# EAGLE design MAGBOT21 (EAGLE 7.6.0)
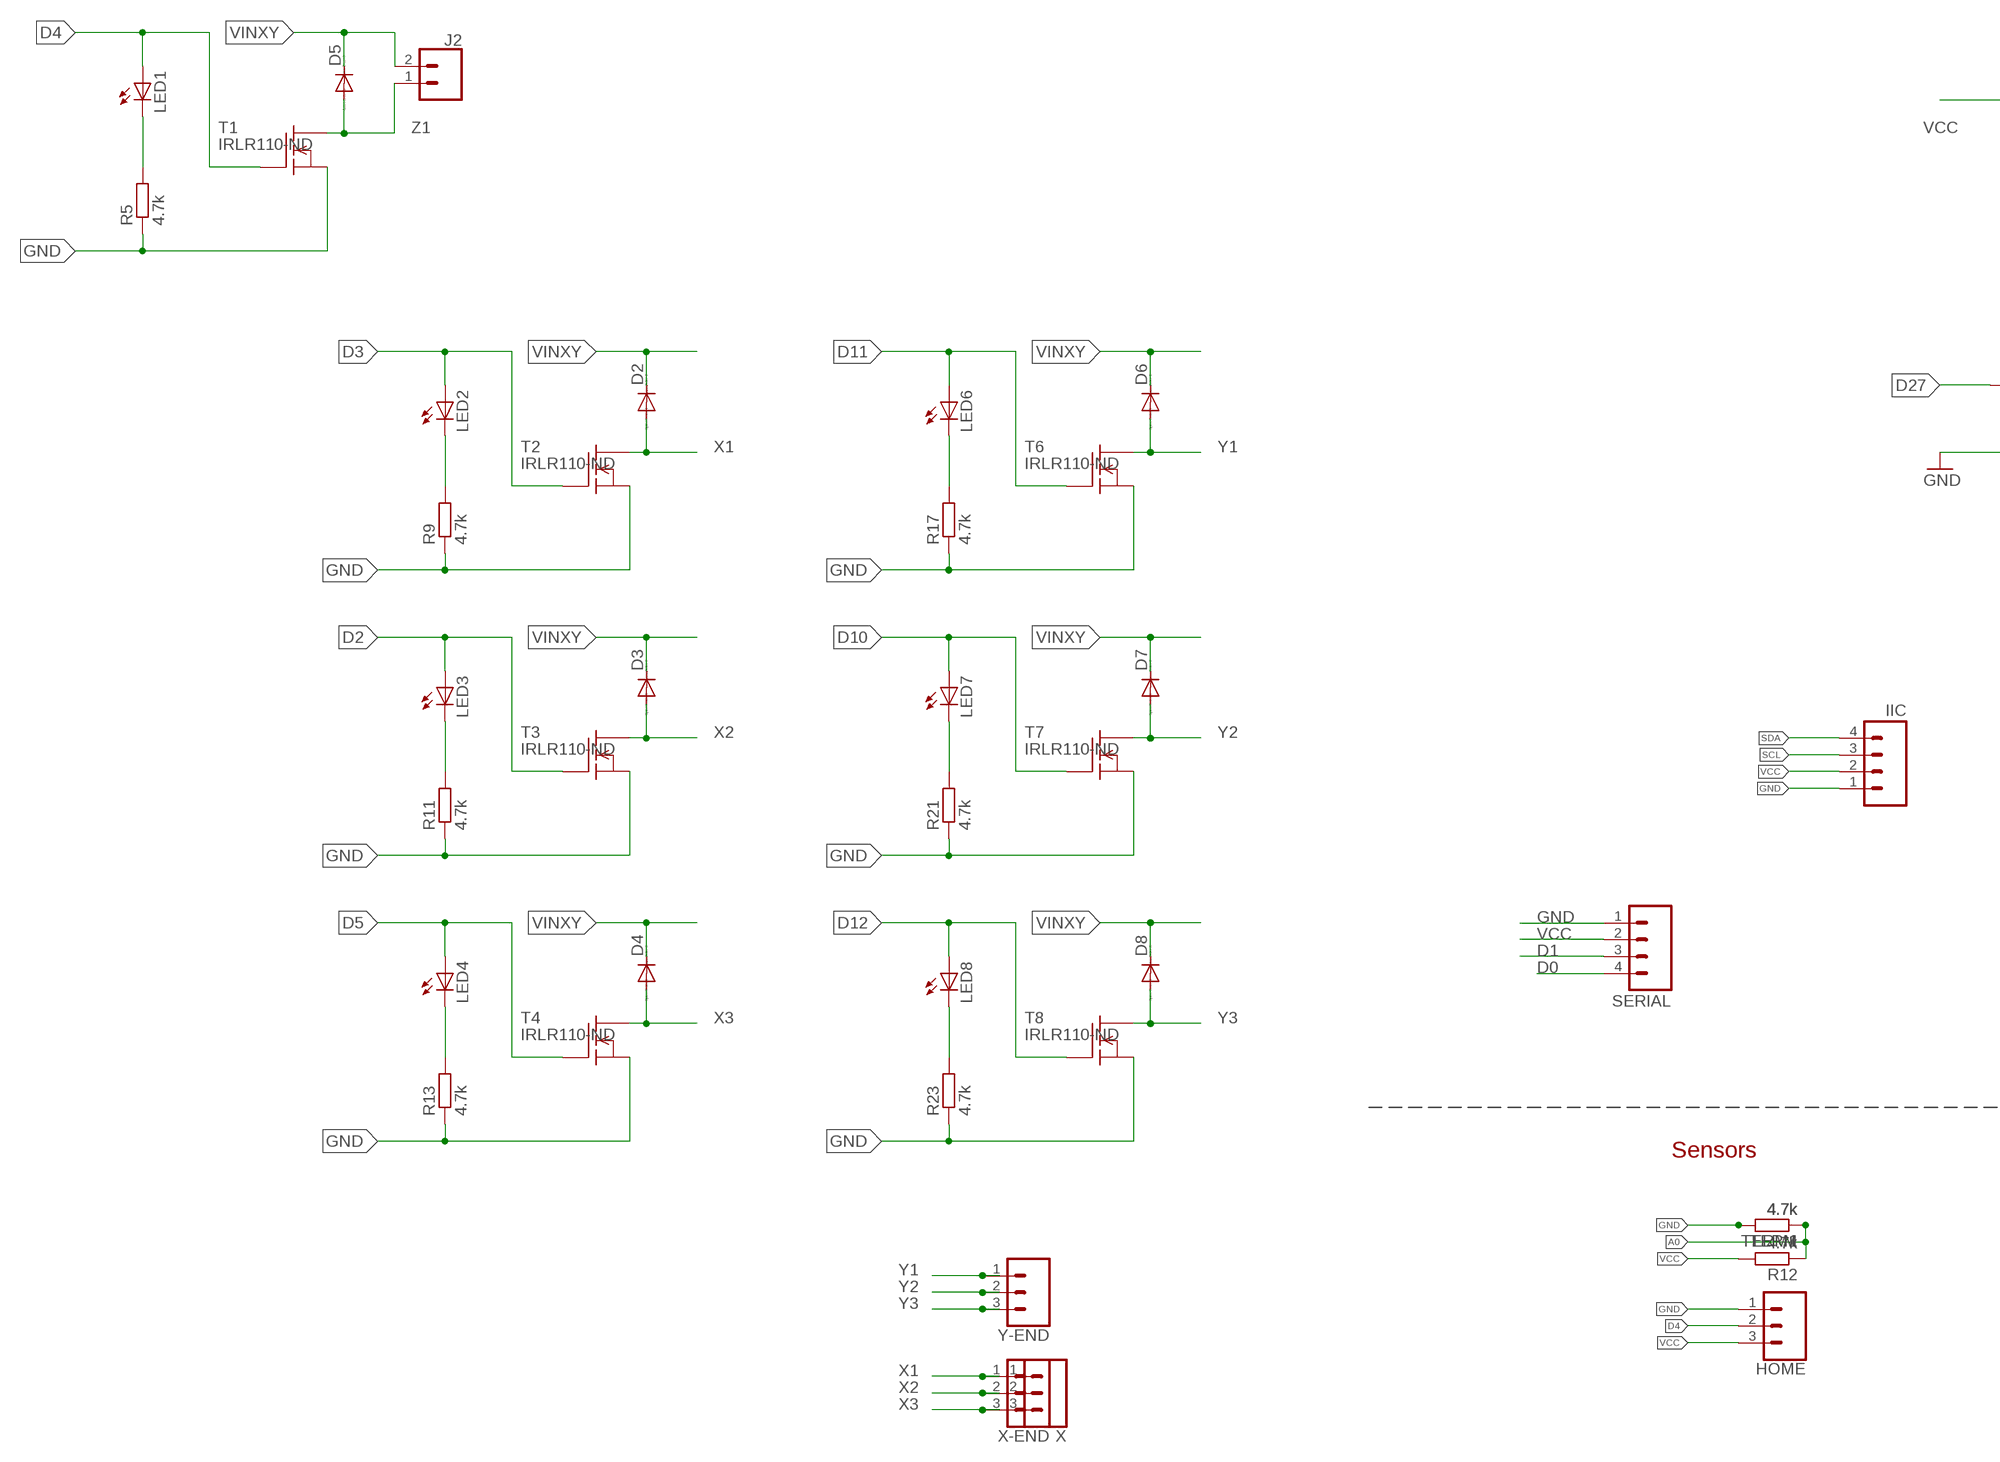
[diagram p0: schematic, sheet 1, part 1 of 2]
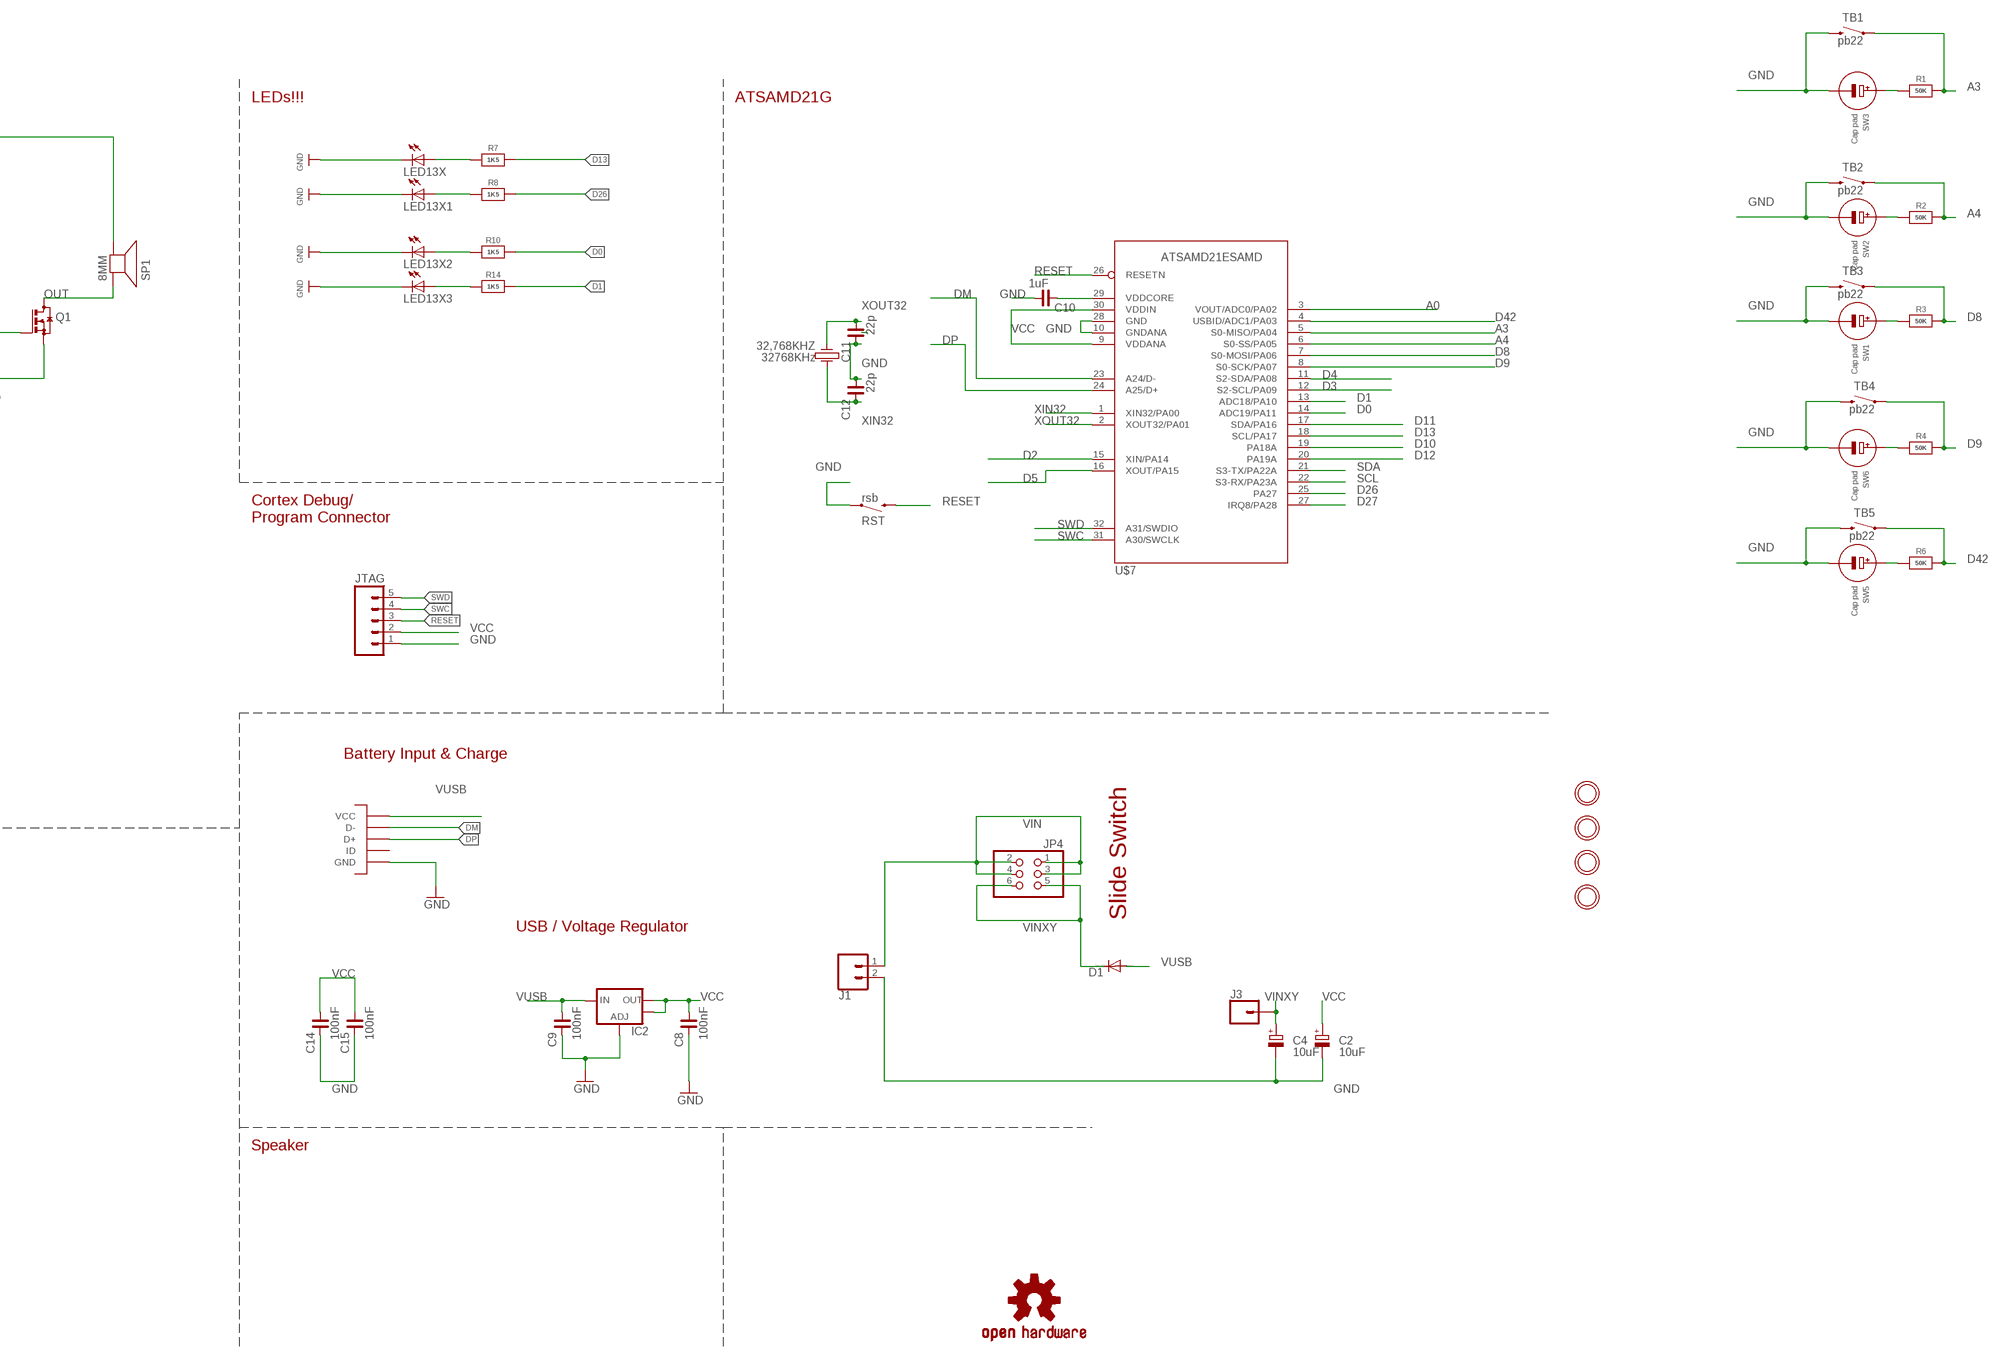
[diagram p1: schematic, sheet 1, part 2 of 2]

## Parts
32,768KHZ  32768KHz  CRYSTALL  [KX-327LT]
C2  10uF  CPOL-EU153CLV-0605  [153CLV-0605]
C4  10uF  CPOL-EU153CLV-0605  [153CLV-0605]
C8  100nF  C_0603  [C0603]
C9  100nF  C_0603  [C0603]
C10  1uF  C_0805  [C0805]
C11  22p  C_0805  [C0805]
C12  22p  C_0805  [C0805]
C14  100nF  C_0805  [C0805]
C15  100nF  C_0805  [C0805]
D1  DIODE-DO214AC  [DO214AC]
D2  DIODE-DO214AC  [DO214AC]
D3  DIODE-DO214AC  [DO214AC]
D4  DIODE-DO214AC  [DO214AC]
D5  DIODE-DO214AC  [DO214AC]
D6  DIODE-DO214AC  [DO214AC]
D7  DIODE-DO214AC  [DO214AC]
D8  DIODE-DO214AC  [DO214AC]
HOME  CONN_031X03_NO_SILK  [1X03_NO_SILK]
IC2  V_REG_LM1117SOT223  [SOT223]
IIC  M041X04_NO_SILK  [1X04_NO_SILK]
J1  CONN_02PTH3  [1X02_LONGPADS]
J2  CONN_02PTH3  [1X02_LONGPADS]
J3  CONN_01PTH_NO_SILK_KIT  [1X01NS_KIT]
JP4  PINHD-2X3  [2X03]
JTAG  M051.27MM  [1X05-1.27MM]
LED1  LEDCHIPLED_0805  [CHIPLED_0805]
LED2  LEDCHIPLED_0805  [CHIPLED_0805]
LED3  LEDCHIPLED_0805  [CHIPLED_0805]
LED4  LEDCHIPLED_0805  [CHIPLED_0805]
LED6  LEDCHIPLED_0805  [CHIPLED_0805]
LED7  LEDCHIPLED_0805  [CHIPLED_0805]
LED8  LEDCHIPLED_0805  [CHIPLED_0805]
LED13X  LEDCHIPLED_0805  [CHIPLED_0805]
LED13X1  LEDCHIPLED_0805  [CHIPLED_0805]
LED13X2  LEDCHIPLED_0603  [CHIPLED_0603]
LED13X3  LEDCHIPLED_0603  [CHIPLED_0603]
LOGO3  OSHW-LOGOS  [OSHW-LOGO-S]
Q1  BSS123  [SOT23]
R1  50K  RESISTOR_0805  [_0805]
R2  50K  RESISTOR_0805  [_0805]
R3  50K  RESISTOR_0805  [_0805]
R4  50K  RESISTOR_0805  [_0805]
R5  4.7k  R-EU_R0603  [R0603]
R6  50K  RESISTOR_0805  [_0805]
R7  1K5  RESISTOR_0805MP  [_0805MP]
R8  1K5  RESISTOR_0603_NOOUT  [0603-NO]
R9  4.7k  R-EU_R0603  [R0603]
R10  1K5  RESISTOR_0603MP  [_0603MP]
R11  4.7k  R-EU_R0603  [R0603]
R12  4.7k  R-EU_R0603  [R0603]
R13  4.7k  R-EU_R0603  [R0603]
R14  1K5  RESISTOR_0603MP  [_0603MP]
R17  4.7k  R-EU_R0603  [R0603]
R21  4.7k  R-EU_R0603  [R0603]
R23  4.7k  R-EU_R0603  [R0603]
RST  rsb  SWITCH-MOMENTARY-2SMD-3  [TACTILE_SWITCH_SMD-3]
SERIAL  M041X04_NO_SILK  [1X04_NO_SILK]
SP1  8MM  SPEAKER_BUZZER5MM  [BUZZER_SMT_5MM]
SW1  Cap pad  SWITCH_CAPTOUCHATMELAT42QT  [CAPTOUCH_SIMPLE_12.5MM]
SW2  Cap pad  SWITCH_CAPTOUCHATMELAT42QT  [CAPTOUCH_SIMPLE_12.5MM]
SW3  Cap pad  SWITCH_CAPTOUCHATMELAT42QT  [CAPTOUCH_SIMPLE_12.5MM]
SW5  Cap pad  SWITCH_CAPTOUCHATMELAT42QT  [CAPTOUCH_SIMPLE_12.5MM]
SW6  Cap pad  SWITCH_CAPTOUCHATMELAT42QT  [CAPTOUCH_SIMPLE_12.5MM]
T1  IRLR110-ND  [TO252]
T2  IRLR110-ND  [TO252]
T3  IRLR110-ND  [TO252]
T4  IRLR110-ND  [TO252]
T6  IRLR110-ND  [TO252]
T7  IRLR110-ND  [TO252]
T8  IRLR110-ND  [TO252]
TB1  pb22  SWITCH-MOMENTARY-2SMD-3  [TACTILE_SWITCH_SMD-3]
TB2  pb22  SWITCH-MOMENTARY-2SMD-3  [TACTILE_SWITCH_SMD-3]
TB3  pb22  SWITCH-MOMENTARY-2SMD-3  [TACTILE_SWITCH_SMD-3]
TB4  pb22  SWITCH-MOMENTARY-2SMD-3  [TACTILE_SWITCH_SMD-3]
TB5  pb22  SWITCH-MOMENTARY-2SMD-3  [TACTILE_SWITCH_SMD-3]
TERM  4.7k  R-EU_R0805W  [R0805W]
TERM1  4.7k  R-EU_R0805W  [R0805W]
U$3  MOUNTINGHOLE2.0  [MOUNTINGHOLE_2.0_PLATED]
U$4  MOUNTINGHOLE2.0  [MOUNTINGHOLE_2.0_PLATED]
U$5  MICROUSB  [MICRO_B]
U$7  ATSAMD21ESAMD  [TQFP32-08]
U$8  MOUNTINGHOLE2.0  [MOUNTINGHOLE_2.0_PLATED]
U$10  MOUNTINGHOLE2.0  [MOUNTINGHOLE_2.0_PLATED]
X  CONN_031X03_NO_SILK  [1X03_NO_SILK]
X-END  CONN_031X03_NO_SILK  [1X03_NO_SILK]
Y-END  CONN_031X03_NO_SILK  [1X03_NO_SILK]

## Nets
A0: R12.1 TERM1.1 TERM.1 U$7.3(VOUT/ADC0/PA02)
A3: R1.1 TB1.1 U$7.5(S0-MISO/PA04)
A4: R2.1 TB2.1 U$7.6(S0-SS/PA05)
D0: R10.1 SERIAL.4 U$7.14(ADC19/PA11)
D1: R14.1 SERIAL.3 U$7.13(ADC18/PA10)
D2: LED3.A T3.1(G) U$7.15(XIN/PA14)
D3: LED2.A T2.1(G) U$7.12(S2-SCL/PA09)
D4: HOME.2 LED1.A T1.1(G) U$7.11(S2-SDA/PA08)
D5: LED4.A T4.1(G) U$7.16(XOUT/PA15)
D8: R3.1 TB3.1 U$7.7(S0-MOSI/PA06)
D9: R4.1 TB4.1 U$7.8(S0-SCK/PA07)
D10: LED7.A T7.1(G) U$7.19(PA18A)
D11: LED6.A T6.1(G) U$7.17(SDA/PA16)
D12: LED8.A T8.1(G) U$7.20(PA19A)
D13: R7.1 U$7.18(SCL/PA17)
D26: R8.1 U$7.25(PA27)
D27: Q1.1(G) U$7.27(IRQ8/PA28)
D42: R6.1 TB5.1 U$7.4(USBID/ADC1/PA03)
DM: U$5.P2(D-) U$7.23(A24/D-)
DP: U$5.P3(D+) U$7.24(A25/D+)
GND [vcc]: C2.- C4.- C8.2 C9.2 C10.1 C11.2 C12.1 C14.2 C15.2 HOME.1 IC2.1(ADJ) IIC.1 J1.2 JTAG.1 LED13X1.C LED13X2.C LED13X3.C LED13X.C Q1.2(S) R5.1 R9.1 R11.1 R13.1 R17.1 R21.1 R23.1 RST.1 SERIAL.1 SW1.G(-) SW2.G(-) SW3.G(-) SW5.G(-) SW6.G(-) T1.2(S) T2.2(S) T3.2(S) T4.2(S) T6.2(S) T7.2(S) T8.2(S) TB1.4 TB2.4 TB3.4 TB4.4 TB5.4 TERM1.2 TERM.2 U$5.GND1(GND) U$5.GND2(GND) U$5.GND3(GND) U$5.GND4(GND) U$5.GND7(GND) U$5.GND8(GND) U$5.P5(GND) U$7.10(GNDANA) U$7.28(GND)
N$1: R6.2 SW5.E(+)
N$2: R4.2 SW6.E(+)
N$3: R3.2 SW1.E(+)
N$5: R2.2 SW2.E(+)
N$6: R1.2 SW3.E(+)
N$7: LED13X1.A R8.2
N$8: LED2.C R9.2
N$10: LED6.C R17.2
N$11: C10.2 U$7.29(VDDCORE)
N$12: LED3.C R11.2
N$14: LED7.C R21.2
N$19: LED4.C R13.2
N$21: LED8.C R23.2
N$22: LED13X.A R7.2
N$23: LED1.C R5.2
N$27: LED13X2.A R10.2
N$28: LED13X3.A R14.2
OUT: Q1.3(D) SP1.+
RESET: JTAG.3 RST.4 U$7.26(RESETN)
SCL: IIC.3 U$7.22(S3-RX/PA23A)
SDA: IIC.4 U$7.21(S3-TX/PA22A)
SWC: JTAG.4 U$7.31(A30/SWCLK)
SWD: JTAG.5 U$7.32(A31/SWDIO)
VCC [gnd]: C2.+ C8.1 C14.1 C15.1 HOME.3 IC2.2(OUT) IC2.4(OUT) IIC.2 JTAG.2 R12.2 SERIAL.2 SP1.- U$7.9(VDDANA) U$7.30(VDDIN)
VIN: J1.1 JP4.1 JP4.2 JP4.3 JP4.4
VINXY [gnd]: C4.+ D1.C D2.C D3.C D4.C D5.C D6.C D7.C D8.C J2.2 J3.1 JP4.5 JP4.6
VUSB: C9.1 D1.A IC2.3(IN) U$5.P1(VCC)
X1: D2.A T2.3(D) X-END.1 X.1
X2: D3.A T3.3(D) X-END.2 X.2
X3: D4.A T4.3(D) X-END.3 X.3
XIN32: 32,768KHZ.1 C12.2 U$7.1(XIN32/PA00)
XOUT32: 32,768KHZ.4 C11.1 U$7.2(XOUT32/PA01)
Y1: D6.A T6.3(D) Y-END.1
Y2: D7.A T7.3(D) Y-END.2
Y3: D8.A T8.3(D) Y-END.3
Z1: D5.A J2.1 T1.3(D)
Unconnected: U$5.P4(ID)

## Notes on the sheet
- LEDs!!! | ATSAMD21G
- Cortex Debug/
  Program Connector
- Battery Input & Charge
- Sensors
- USB / Voltage Regulator | Slide Switch
- Speaker

## Library data of the parts
32,768KHZ = es:CRYSTALL
C2 C4 = rcl:CPOL-EU: POLARIZED CAPACITOR, European symbol
C8-C12 C14 C15 = rc-master-smd:C_: NON-POLARIZED CAP
D1-D8 = diode:DIODE-: DIODE
HOME X X-END Y-END = SparkFun-Connectors:CONN_03: Multi connection point. Often used as Generic Header-pin footprint for 0.1 inch spaced/style header connections On any of the 0.1 inch spaced packages, you can populate with these: Break Away Headers - Straight <https://www.sparkfun.com/products/116> (PRT-00116) Break Away Male Headers - Right Angle <https://www.sparkfun.com/products/553> (PRT-00553) Female Headers <https://www.sparkfun.com/products/115> (PRT-00115) Break Away Headers - Machine Pin <https://www.sparkfun.com/products/117> (PRT-00117) Break Away Female Headers - Swiss Machine Pin <https://www.sparkfun.com/products/743> (PRT-00743) Stackable Header - 3 Pin (Female, 0.1") <https://www.sparkfun.com/products/13875> (PRT-13875) For SCREWTERMINALS and SPRING TERMINALS visit here: Screw Terimnals on SparkFun.com <https://www.sparkfun.com/search/results?term=Screw+Terminals> (5mm/3.5mm/2.54mm spacing) This device is also useful as a general connection point to wire up your design to another part of your project. Our various solder wires solder well into these plated through hole pads. Hook-Up Wire - Assortment (Stranded, 22 AWG) <https://www.sparkfun.com/products/11375> (PRT-11375) Hook-Up Wire - Assortment (Solid Core, 22 AWG) <https://www.sparkfun.com/products/11367> (PRT-11367) View the entire wire category on our website here <https://www.sparkfun.com/categories/141> Special notes: Molex polarized connector foot print use with SKU : PRT-08232 with associated crimp pins and housings.
IC2 = SparkFun:V_REG_LM1117: Voltage Regulator LM1117 Standard adjustable voltage regulator but in SMD form. Spark Fun Electronics SKU : COM-00595
IIC SERIAL = SparkFun:M04: Header 4 Standard 4-pin 0.1" header. Use with straight break away headers (SKU : PRT-00116), right angle break away headers (PRT-00553), swiss pins (PRT-00743), machine pins (PRT-00117), and female headers (PRT-00115). Molex polarized connector foot print use with SKU : PRT-08231 with associated crimp pins and housings.
J1 J2 = SparkFun-Connectors:CONN_02: Multi connection point. Often used as Generic Header-pin footprint for 0.1 inch spaced/style header connections On any of the 0.1 inch spaced packages, you can populate with these: Break Away Headers - Straight <https://www.sparkfun.com/products/116> (PRT-00116) Break Away Male Headers - Right Angle <https://www.sparkfun.com/products/553> (PRT-00553) Female Headers <https://www.sparkfun.com/products/115> (PRT-00115) Break Away Headers - Machine Pin <https://www.sparkfun.com/products/117> (PRT-00117) Break Away Female Headers - Swiss Machine Pin <https://www.sparkfun.com/products/743> (PRT-00743) For SCREWTERMINALS and SPRING TERMINALS visit here: Screw Terimnals on SparkFun.com <https://www.sparkfun.com/search/results?term=Screw+Terminals> (5mm/3.5mm/2.54mm spacing) This device is also useful as a general connection point to wire up your design to another part of your project. Our various solder wires solder well into these plated through hole pads. Hook-Up Wire - Assortment (Stranded, 22 AWG) <https://www.sparkfun.com/products/11375> (PRT-11375) Hook-Up Wire - Assortment (Solid Core, 22 AWG) <https://www.sparkfun.com/products/11367> (PRT-11367) View the entire wire category on our website here <https://www.sparkfun.com/categories/141> Special notes: Molex polarized connector foot print use with: PRT-08233 with associated crimp pins and housings. 2.54_SCREWTERM for use with PRT-10571. 3.5mm Screw Terminal footprints for PRT-08084 5mm Screw Terminal footprints for use with PRT-08432
J3 = SparkFun-Connectors:CONN_01: Single connection point. Often used as Generic Header-pin footprint for 0.1 inch spaced/style header connections On any of the 0.1 inch spaced packages, you can populate with these: Break Away Headers - Straight <https://www.sparkfun.com/products/116> (PRT-00116) Break Away Male Headers - Right Angle <https://www.sparkfun.com/products/553> (PRT-00553) Female Headers <https://www.sparkfun.com/products/115> (PRT-00115) Break Away Headers - Machine Pin <https://www.sparkfun.com/products/117> (PRT-00117) Break Away Female Headers - Swiss Machine Pin <https://www.sparkfun.com/products/743> (PRT-00743) This device is also useful as a general connection point to wire up your design to another part of your project. Our various solder wires solder well into these plated through hole pads. Hook-Up Wire - Assortment (Stranded, 22 AWG) <https://www.sparkfun.com/products/11375> (PRT-11375) Hook-Up Wire - Assortment (Solid Core, 22 AWG) <https://www.sparkfun.com/products/11367> (PRT-11367) View the entire wire category on our website here <https://www.sparkfun.com/categories/141> Special notes: SMTSO-256-ET is a "flush mount" nut for a 4-40 screw. We mostly use this on specialty testbeds; it is a nice way to connect hardware to your PCB at an adjustable hieght. Also note, the SNAP packages are for using a snappable style connector. We sell a baggie of snaps and they are also used on two LilyPad designs: Snap Assortment - 30 pack (male and female) <https://www.sparkfun.com/products/11347> (DEV-11347) LilyPad Arduino SimpleSnap <https://www.sparkfun.com/products/10941> (DEV-10941) LilyPad SimpleSnap Protoboard <https://www.sparkfun.com/products/10940> (DEV-10940)
JP4 = pinhead:PINHD-2X3: PIN HEADER
JTAG = SparkFun-Connectors:M05: Header 5 Standard 5-pin 0.1" header. Use with straight break away headers (SKU : PRT-00116), right angle break away headers (PRT-00553), swiss pins (PRT-00743), machine pins (PRT-00117), and female headers (PRT-00115). Molex polarized connector foot print use with SKU : PRT-08230 with associated crimp pins and housings.
LED1-LED4 LED6-LED8 LED13X LED13X1-LED13X3 = led:LED: LED OSRAM: - CHIPLED LG R971, LG N971, LY N971, LG Q971, LY Q971, LO R971, LY R971 LH N974, LH R974 LS Q976, LO Q976, LY Q976 LO Q996 - Hyper CHIPLED LW Q18S LB Q993, LB Q99A, LB R99A - SideLED LS A670, LO A670, LY A670, LG A670, LP A670 LB A673, LV A673, LT A673, LW A673 LH A674 LY A675 LS A676, LA A676, LO A676, LY A676, LW A676 LS A679, LY A679, LG A679 - Hyper Micro SIDELED® LS Y876, LA Y876, LO Y876, LY Y876 LT Y87S - SmartLED LW L88C, LW L88S LB L89C, LB L89S, LG L890 LS L89K, LO L89K, LY L89K LS L896, LA L896, LO L896, LY L896 - TOPLED LS T670, LO T670, LY T670, LG T670, LP T670 LSG T670, LSP T670, LSY T670, LOP T670, LYG T670 LG T671, LOG T671, LSG T671 LB T673, LV T673, LT T673, LW T673 LH T674 LS T676, LA T676, LO T676, LY T676, LB T676, LH T676, LSB T676, LW T676 LB T67C, LV T67C, LT T67C, LS T67K, LO T67K, LY T67K, LW E67C LS E67B, LA E67B, LO E67B, LY E67B, LB E67C, LV E67C, LT E67C LW T67C LS T679, LY T679, LG T679 LS T770, LO T770, LY T770, LG T770, LP T770 LB T773, LV T773, LT T773, LW T773 LH T774 LS E675, LA E675, LY E675, LS T675 LS T776, LA T776, LO T776, LY T776, LB T776 LHGB T686 LT T68C, LB T68C - Hyper Mini TOPLED® LB M676 - Mini TOPLED Santana® LG M470 LS M47K, LO M47K, LY M47K Source: http://www.osram.convergy.de LUXEON: - LUMILED® LXK2-PW12-R00, LXK2-PW12-S00, LXK2-PW14-U00, LXK2-PW14-V00 LXK2-PM12-R00, LXK2-PM12-S00, LXK2-PM14-U00 LXK2-PE12-Q00, LXK2-PE12-R00, LXK2-PE12-S00, LXK2-PE14-T00, LXK2-PE14-U00 LXK2-PB12-K00, LXK2-PB12-L00, LXK2-PB12-M00, LXK2-PB14-N00, LXK2-PB14-P00, LXK2-PB14-Q00 LXK2-PR12-L00, LXK2-PR12-M00, LXK2-PR14-Q00, LXK2-PR14-R00 LXK2-PD12-Q00, LXK2-PD12-R00, LXK2-PD12-S00 LXK2-PH12-R00, LXK2-PH12-S00 LXK2-PL12-P00, LXK2-PL12-Q00, LXK2-PL12-R00 Source: www.luxeon.com KINGBRIGHT: KA-3528ASYC Source: www.kingbright.com
LOGO3 = SparkFun-Aesthetics:OSHW-LOGO: Open Source Hardware Logo This logo indicates the piece of hardware it is found on incorporates a OSHW license and/or adheres to the definition of open source hardware found here: http://freedomdefined.org/OSHW
Q1 = transistor-small-signal:BSS123: N-CHANNEL MOS FET
R1-R4 R6-R8 R10 R14 = microbuilder:RESISTOR: Resistors For new designs, use the packages preceded by an '_' character since they are more reliable: The following footprints should be used on most boards: _0402 - Standard footprint for regular board layouts _0603 - Standard footprint for regular board layouts _0805 - Standard footprint for regular board layouts _1206 - Standard footprint for regular board layouts For extremely tight-pitch boards where space is at a premium, the following 'micro-pitch' footprints can be used (smaller pads, no silkscreen outline, etc.): _0402MP - Micro-pitch footprint for very dense/compact boards _0603MP - Micro-pitch footprint for very dense/compact boards _0805MP - Micro-pitch footprint for very dense/compact boards _1206MP - Micro-pitch footprint for very dense/compact boards
R5 R9 R11-R13 R17 R21 R23 TERM TERM1 = rcl:R-EU_: RESISTOR, European symbol
RST TB1-TB5 = SparkFun-Electromechanical:SWITCH-MOMENTARY-2: Various NO switches- pushbuttons, reed, etc
SP1 = microbuilder:SPEAKER: SPEAKER Source: Buerklin Added PS12 (for part # PS1240 piezo) http://www.ladyada.net/library/pcb/eaglelibrary.html
SW1-SW3 SW5 SW6 = microbuilder:SWITCH_CAPTOUCH: Capacitive Touch Electrodes
T1-T4 T6-T8 = JVN:IRLR110-ND
U$3 U$4 U$8 U$10 = microbuilder:MOUNTINGHOLE: Mounting Hole For #2 screws (0.086"/2.18mm width, 0.094"/2.4mm hole) use 2.5mm; BOM: EXCLUDE
U$5 = Other:MICROUSB
U$7 = atsamd21E:ATSAMD21E

## Net classes
0 default: width 0.229 mm, drill 0.381 mm, clearance 0.254 mm
1 vcc: width 0.305 mm, drill 0.381 mm, clearance 0.254 mm
2 gnd: width 0.305 mm, drill 0.381 mm, clearance 0.254 mm

## Board
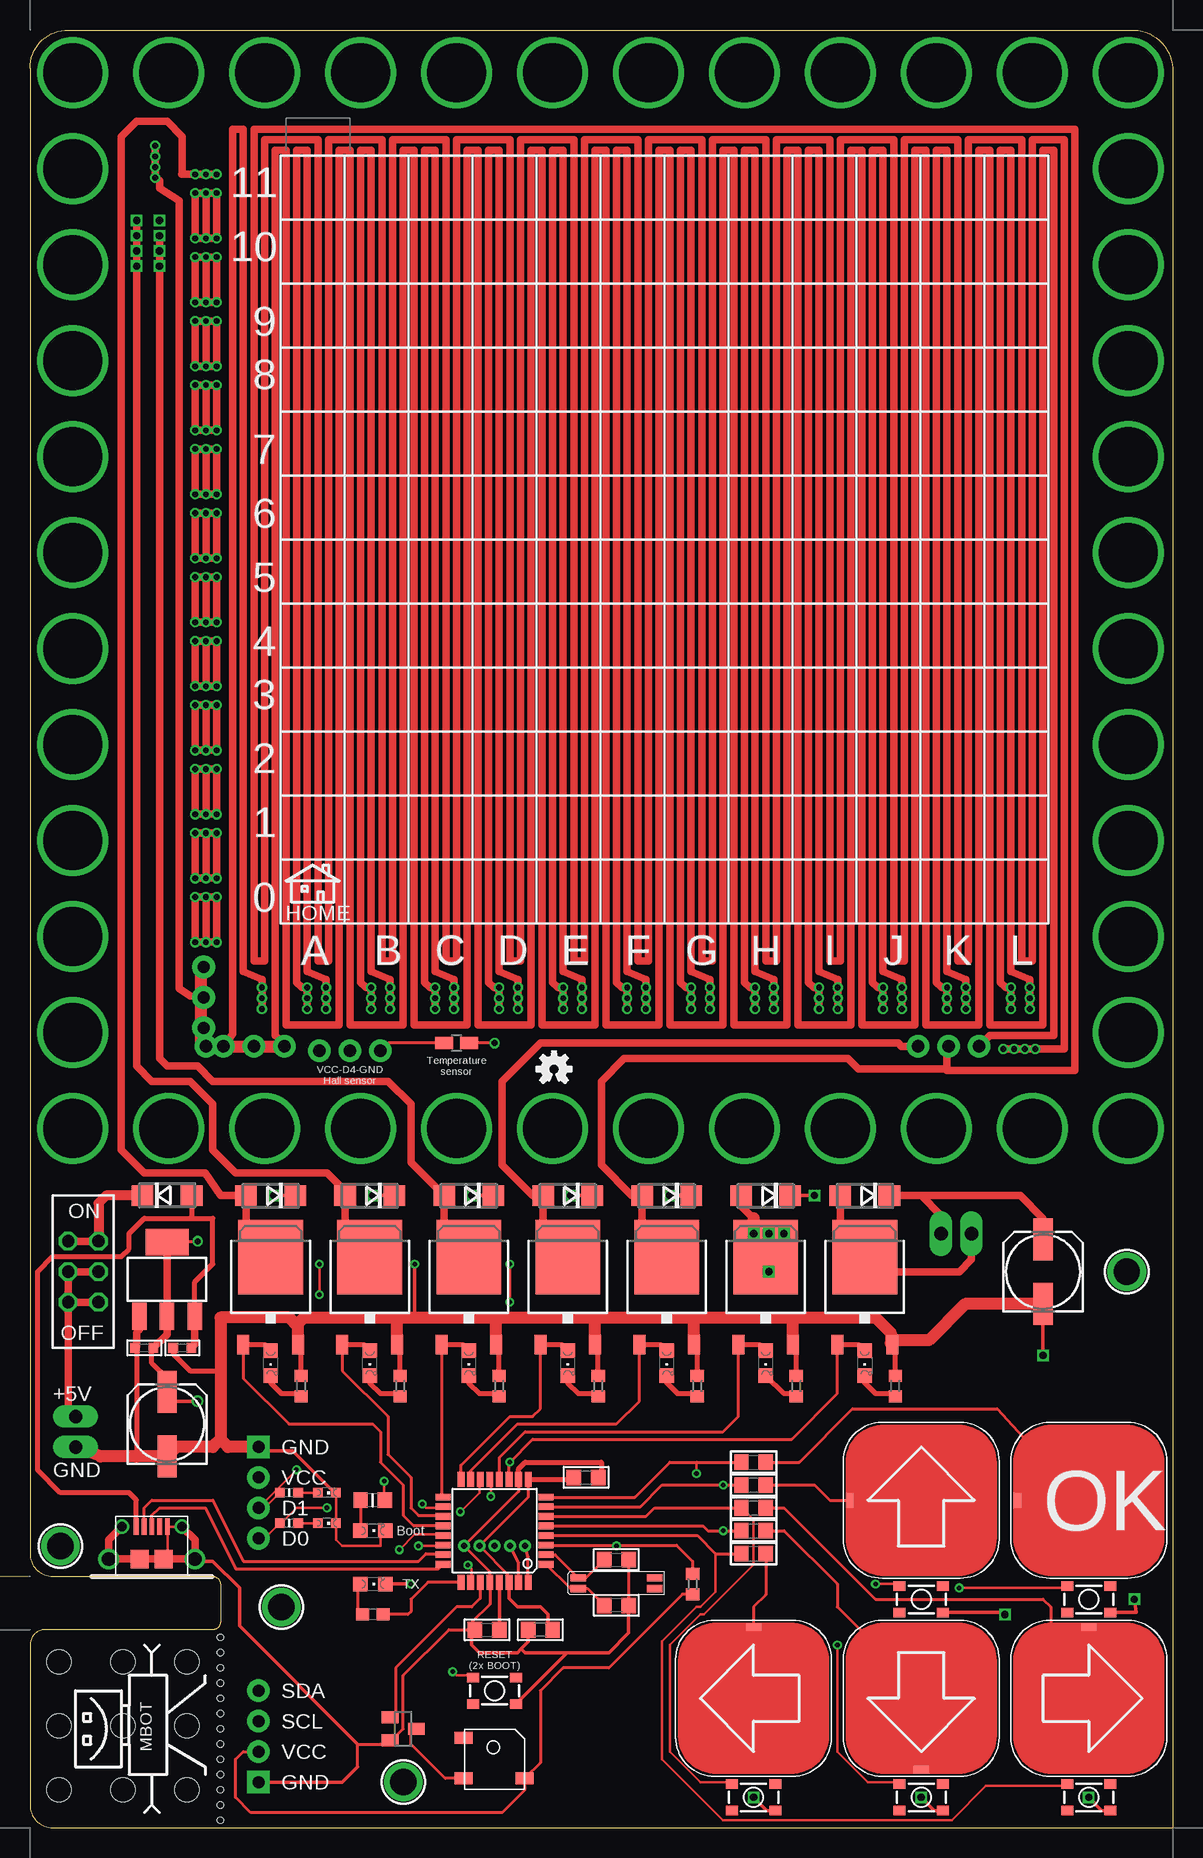
[diagram p2: board, top side]
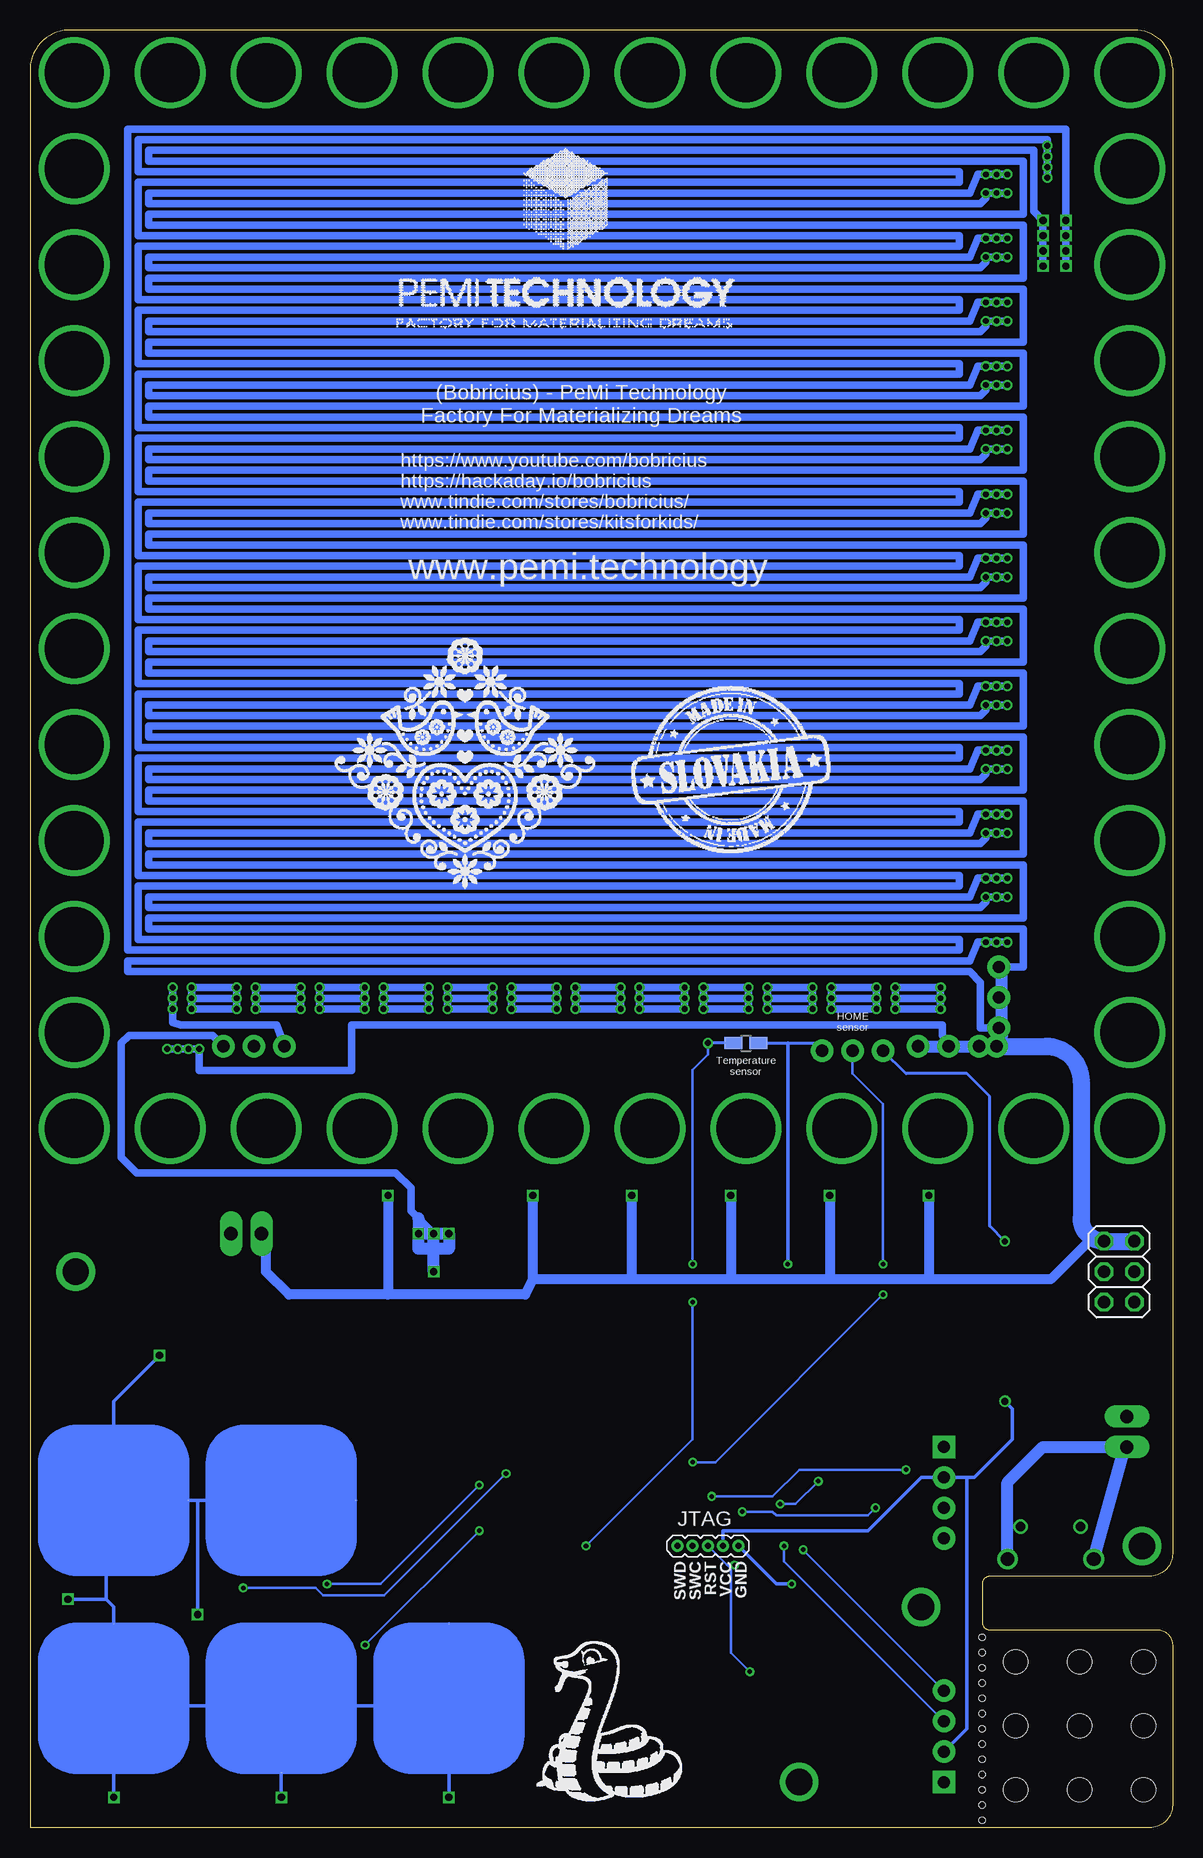
[diagram p3: board, bottom side, seen from below]

Size 95.25 x 149.86 mm. Coordinates in mm from the lower left corner, seen from the top.
Outline: 0,146.69 0,22.86 arc90 1.9,20.95 15.24,20.95 arc-90 15.88,20.32 15.88,17.14 arc-90 15.24,16.51 1.27,16.51 arc90 0,15.24 0,1.91 arc90 1.9,0 95.25,0 95.25,146.69 arc83 92.07,149.86 3.17,149.86 arc90 0,146.69
Copper layers (1*16): Top 0.0356mm / dielectric 1.5011mm / Bottom 0.0356mm
Design rules "LaenPCBOrder *": minimum track width 6mil, minimum drill 13mil, track to track 6mil, track to pad 6mil, pad to pad 6mil, via to via 6mil, smd to smd 6mil, copper to edge 15mil, drill to drill 6mil, minimum pad ring 7mil, minimum via ring 7mil, stop-mask expansion 4mil, vias tented up to drill 30mil, thermal gap 10mil
Holes 2 mm at 13.08,3.17 13.08,8.51 7.75,3.17 7.75,13.84 13.08,13.84 2.41,13.84 2.41,8.51 2.41,3.17 7.75,8.51
Holes 0.5 mm at 15.88,6.98 15.88,8.26 15.88,9.53 15.88,10.79 15.88,12.07 15.88,13.34 15.88,14.61 15.88,15.88 15.88,5.71 15.88,4.45 15.88,3.17 15.88,1.91 15.88,0.64

### Footprints (pad centres in the part's own frame; a part is rotated, then mirrored left to right if it is on the bottom)
KX-327LT = smd 1.3 x 0.6: 1 -3.2,-0.5; 2 3.2,-0.5; 3 3.2,0.4; 4 -3.2,0.4
153CLV-0605 = smd 3.5 x 1.6: + 2.7,0; - -2.7,0
C0603 = smd 0.8 x 0.8: 1 -0.762,0; 2 0.762,0
C0805 = smd 1.2 x 1.3: 1 -1.016,0; 2 1.016,0
DO214AC = smd 1.8 x 1.7: A 2.05,0; C -2.05,0
1X03_NO_SILK = drill 1.016 pad 1.88: 1 0,0; 2 2.54,0; 3 5.08,0
SOT223 = smd 1.219 x 2.235: 1 -2.311,-3.099; 2 0,-3.099; 3 2.311,-3.099 | smd 3.6 x 2.2: 4 0,3.099
1X04_NO_SILK = drill 1.016 pad 1.88 square: 1 0,0 | drill 1.016 pad 1.88: 2 2.54,0; 3 5.08,0; 4 7.62,0
1X02_LONGPADS = drill 1.118 pad 1.88 long: 1 0,0; 2 2.54,0
1X01NS_KIT = drill 1.016 pad 1.88: 1 0,0
2X03 = drill 1.016 octagon: 1 -2.54,-1.27; 2 -2.54,1.27; 3 0,-1.27; 4 0,1.27; 5 2.54,-1.27; 6 2.54,1.27
1X05-1.27MM = drill 0.508 pad 1: 1 0,0; 2 1.27,0; 3 2.54,0; 4 3.81,0; 5 5.08,0
CHIPLED_0805 = smd 1.2 x 1.2: A 0,-1.05; C 0,1.05
CHIPLED_0603 = smd 0.8 x 0.8: A 0,-0.75; C 0,0.75
SOT23 = smd 1 x 1.4: 1 -0.95,-1.1; 2 0.95,-1.1; 3 0,1.1
_0805 = smd 1.2 x 1.3: 1 -1.016,0; 2 1.016,0
R0603 = smd 1 x 1.1: 1 -0.85,0; 2 0.85,0
_0805MP = smd 1.2 x 1.3: 1 -1.016,0; 2 1.016,0
0603-NO = smd 1.1 x 1: 1 -0.85,0; 2 0.85,0
_0603MP = smd 0.8 x 0.8: 1 -0.762,0; 2 0.762,0
TACTILE_SWITCH_SMD-3 = smd 1 x 0.8: 1 -1.8,1.1; 2 1.8,1.1; 3 -1.8,-1.1; 4 1.8,-1.1
BUZZER_SMT_5MM = smd 1.5 x 1: + -2.6,-1.6; - 2.5,-1.6; MT -2.6,1.8
CAPTOUCH_SIMPLE_12.5MM = smd 1.27 x 0.635: E 0,-5.95 | smd 0.1 x 0.1 bottom: G 0,-6.2
TO252 = smd 1 x 1.6: 1 -2.28,-4.8; 2 2.28,-4.8 | smd 5.4 x 6.2: 3 0,2.5
R0805W = smd 1.5 x 1: 1 -1.052,0; 2 1.052,0
MOUNTINGHOLE_2.0_PLATED = drill 2.2 pad 3: P$1 0,0
MICRO_B = smd 1.5 x 1.55: GND1 -1,1.45; GND2 1,1.45 | drill 0.8: GND3 -2.5,4.15; GND4 2.5,4.15 | drill 1.15: GND7 -3.598,1.45; GND8 3.598,1.45 | smd 0.4 x 1.35: P1 -1.3,4.15; P2 -0.65,4.15; P3 0,4.15; P4 0.65,4.15; P5 1.3,4.15
TQFP32-08 = smd 1.27 x 0.559: 1 -4.293,2.8; 2 -4.293,2; 3 -4.293,1.2; 4 -4.293,0.4; 5 -4.293,-0.4; 6 -4.293,-1.2; 7 -4.293,-2; 8 -4.293,-2.8; 17 4.293,-2.8; 18 4.293,-2; 19 4.293,-1.2; 20 4.293,-0.4; 21 4.293,0.4; 22 4.293,1.2; 23 4.293,2; 24 4.293,2.8 | smd 0.559 x 1.27: 9 -2.8,-4.293; 10 -2,-4.293; 11 -1.2,-4.293; 12 -0.4,-4.293; 13 0.4,-4.293; 14 1.2,-4.293; 15 2,-4.293; 16 2.8,-4.293; 25 2.8,4.293; 26 2,4.293; 27 1.2,4.293; 28 0.4,4.293; 29 -0.4,4.293; 30 -1.2,4.293; 31 -2,4.293; 32 -2.8,4.293

### Placement (x,y rotation side)
32,768KHZ  48.9,20.45 0 top
C2  11.43,33.66 90 top
C4  84.46,46.36 90 top
C8  9.53,40.01 180 top
C9  12.7,40.01 180 top
C10  38.1,16.51 0 top
C11  48.9,22.35 0 top
C12  48.9,18.54 180 top
C14  42.55,16.51 180 top
C15  46.35,29.21 0 top
D1  11.43,52.71 0 top
D2  61.34,52.71 180 top
D3  53.09,52.71 180 top
D4  44.83,52.71 180 top
D5  69.6,52.71 180 top
D6  36.58,52.71 180 top
D7  28.32,52.71 180 top
D8  20.07,52.71 180 top
HOME  29.21,64.77 180 top
IC2  11.43,45.72 0 top
IIC  19.05,3.81 90 top
J1  3.81,34.29 270 bottom
J2  78.49,49.53 180 top
J3  14.67,65.15 90 top
JP4  4.45,46.36 90 bottom
JTAG  36.2,23.49 180 bottom
LED1  69.6,38.73 180 top
LED2  61.34,38.73 180 top
LED3  53.09,38.73 180 top
LED4  44.83,38.73 180 top
LED6  36.58,38.73 180 top
LED7  28.32,38.73 180 top
LED8  20.07,38.73 180 top
LED13X  28.58,24.76 270 top
LED13X1  28.58,20.32 270 top
LED13X2  24.77,25.4 270 top
LED13X3  24.77,27.94 270 top
LOGO3  43.69,63.25 0 top
Q1  31.12,8.26 270 top
R1  60.32,24.76 0 top
R2  60.32,26.67 0 top
R3  60.32,28.57 0 top
R4  60.32,30.48 0 top
R5  72.14,36.83 270 top
R6  60.32,22.86 0 top
R7  28.58,27.3 180 top
R8  28.58,17.78 180 top
R9  63.88,36.83 270 top
R10  21.59,25.4 0 top
R11  55.63,36.83 270 top
R12  55.24,20.32 270 top
R13  47.37,36.83 270 top
R14  21.59,27.94 0 top
R17  39.12,36.83 270 top
R21  30.86,36.83 270 top
R23  22.61,36.83 270 top
RST  38.73,11.43 180 top
SERIAL  19.05,31.75 270 top
SP1  38.73,5.71 0 top
SW1  74.29,27.3 270 top
SW2  88.26,10.79 180 top
SW3  74.29,10.79 0 top
SW5  60.32,10.79 180 top
SW6  88.26,27.3 270 top
T1  69.6,45.09 0 top
T2  61.34,45.09 0 top
T3  53.09,45.09 0 top
T4  44.83,45.09 0 top
T6  36.58,45.09 0 top
T7  28.32,45.09 0 top
T8  20.07,45.09 0 top
TB1  74.29,2.54 0 top
TB2  60.32,2.54 0 top
TB3  74.29,19.05 0 top
TB4  88.26,19.05 0 top
TB5  88.26,2.54 0 top
TERM  35.56,65.41 180 top
TERM1  35.56,65.41 0 bottom
U$3  31.12,3.81 0 top
U$4  2.54,23.49 0 top
U$5  10.16,20.95 0 top
U$7  38.73,24.76 180 top
U$8  20.95,18.41 0 top
U$10  91.44,46.36 0 top
X  79.12,65.15 180 top
X-END  21.21,65.15 180 top
Y-END  14.48,71.75 270 top

### Tracks (layer width: path | path; a pad name or v marks a point on that pad's centre or on a via)
A0  (via drill 0.38, 0.5)
  Top 0.229: v40.01,43.82 v40.01,46.99 | v48.9,23.49 48.9,23.56
  Top 0.254: U$7.3 48.9,23.56 53.91,23.56 55.24,22.22 R12.1 | v38.73,65.41 TERM1.1
  Bottom 0.229: v38.73,65.41 38.73,64.45 40.01,63.18 v40.01,46.99 | v40.01,43.82 40.01,32.38 v48.9,23.49
  Bottom 0.254: TERM1.1 v38.73,65.41
A3  (via drill 0.38)
  Top 0.229: v67.31,15.24 67.31,6.35 69.85,3.81 72.39,3.81 TB1.1
  Top 0.254: U$7.5 56.12,25.16 56.52,24.76 v57.78,24.76 R1.1
  Bottom 0.229: v57.78,24.76 v67.31,15.24
A4
  Top 0.229: TB2.1 58.42,3.81 55.88,3.81 53.34,6.35 53.34,15.24 55.88,17.78 56.2,17.78 60.32,21.91 60.32,25.72 59.37,26.67 R2.1
  Top 0.254: U$7.6 51.37,25.96 52.07,26.67 R2.1
D0  (via drill 0.38)
  Top 0.203: SERIAL.4 19.56,24.13 R10.1
  Top 0.229: v35.88,26.35 37.46,27.94 37.46,28.89 U$7.14 | v24.77,26.67 22.23,26.67 20.95,25.4 R10.1
  Bottom 0.229: v35.88,26.35 33.34,26.35 33.02,26.04 25.4,26.04 v24.77,26.67
D1  (via drill 0.38)
  Top 0.203: SERIAL.3 19.56,26.67 R14.1
  Top 0.229: v38.42,27.62 38.42,28.89 U$7.13 | SERIAL.3 v22.23,29.84
  Bottom 0.229: v38.42,27.62 33.34,27.62 31.12,29.84 v22.23,29.84
D2
  Top 0.254: U$7.15 36.73,29.75 40.64,33.66 48.9,33.66 50.8,35.56 T3.1
  Top 0.406: T3.1 52.59,40.29 LED3.A
D3
  Top 0.254: U$7.12 39.13,30.88 41.27,33.02 57.78,33.02 59.05,34.29 T2.1
  Top 0.406: T2.1 60.84,40.29 LED2.A
D4  (via drill 0.38)
  Top 0.229: v24.13,44.45 v24.13,46.99
  Top 0.254: U$7.11 39.94,30.41 v40.01,30.48 41.91,32.38 63.5,32.38 67.31,36.2 T1.1
  Top 0.406: T1.1 69.1,40.29 LED1.A
  Bottom 0.229: HOME.2 26.67,62.87 24.13,60.33 v24.13,46.99 | v24.13,44.45 38.1,30.48 v40.01,30.48
D5
  Top 0.254: U$7.16 35.94,30.22 40.01,34.29 41.91,34.29 42.55,34.92 T4.1
  Top 0.406: T4.1 44.33,40.29 LED4.A
D8  (via drill 0.38)
  Top 0.229: v70.49,20.32 72.39,20.32 TB3.1
  Top 0.254: U$7.7 50.9,26.76 52.7,28.57 v57.78,28.57 R3.1
  Bottom 0.229: v70.49,20.32 66.04,20.32 v57.78,28.57
D9  (via drill 0.38)
  Top 0.229: v77.47,20 86.36,20 TB4.1 | 55.56,30.48 v55.56,29.53
  Top 0.254: U$7.8 50.42,27.56 53.34,30.48 55.56,30.48 R4.1
  Bottom 0.229: v77.47,20 71.44,20 70.8,19.37 65.72,19.37 v55.56,29.53
D10
  Top 0.254: T7.1 26.04,38.09 29.84,34.29 29.84,31.11 31.75,29.21 31.75,26.67 32.38,26.04 34.37,26.04 U$7.19
  Top 0.406: T7.1 27.82,40.29 LED7.A
D11
  Top 0.254: T6.1 34.3,27.71 U$7.17
  Top 0.406: T6.1 36.08,40.29 LED6.A
D12
  Top 0.254: T8.1 17.79,37.46 21.59,33.66 28.58,33.66 29.21,33.02 29.21,30.48 31.12,28.57 31.12,26.04 31.98,25.16 U$7.20
  Top 0.406: T8.1 19.57,40.29 LED8.A
D13  (via drill 0.38)
  Top 0.229: v32.7,26.99 33.02,26.67 34.29,26.67 U$7.18 | v29.53,28.89 29.53,27.3 R7.1
  Bottom 0.229: v32.7,26.99 31.43,26.99 v29.53,28.89
D26
  Top 0.254: U$7.25 33.17,20.47 31.75,19.05 31.75,18.03 31.5,17.78 R8.1
D27
  Top 0.254: U$7.27 37.53,19.12 36.83,18.41 35.56,18.41 30.48,13.34 30.48,9.67 Q1.1
D42
  Top 0.229: 57.15,22.86 57.15,19.68 55.88,18.41 55.56,18.41 52.7,15.56 52.7,5.71 57.78,0.64 76.84,0.64 79.69,3.49 86.36,3.49 TB5.1
  Top 0.254: U$7.4 55.65,24.36 57.15,22.86 R6.1
DM
  Top 0.254: U$5.P2 9.51,26.65 10.16,27.3 15.24,27.3 17.78,22.22 32.38,22.22 33.02,22.86 34.35,22.86 U$7.23
DP
  Top 0.254: U$5.P3 10.16,26.04 10.79,26.67 14.61,26.67 17.14,21.59 34.07,21.59 U$7.24
GND  (via drill 0.38, 0.6)
  Top 0.203: LED13X3.C LED13X2.C 25.52,24.01 26.04,23.49 29.21,23.49 29.21,24.35 LED13X.C | U$5.GND4 U$5.P5 11.46,22.25 11.43,22.22 13.97,22.22
  Top 0.254: C11.2 C12.1 | U$7.10 40.73,28.04 JTAG.1 38.34,21.36 U$7.28 38.34,18.65 36.83,17.14 36.83,16.76 C10.1 34.92,16.51 31.12,12.7 31.12,8.26 30.16,7.3 Q1.2 29.84,7.13 29.21,6.98 27.3,6.98 27.3,5.08 | TERM1.2 29.84,65.41 HOME.1
  Top 0.305: TB2.4 61.43,1.44 v60.32,2.54 | TB1.4 75.4,1.44 v74.29,2.54 | TB5.4 89.37,1.44 v88.26,2.54 | v84.46,39.37 C4.- | TB3.4 81.11,17.95 v81.28,17.78 | TB4.4 92.25,17.95 v92.07,19.05 | 27.3,5.08 26.04,3.81 IIC.1 | C14.2 41.53,15.49 40.96,14.92 | 40.96,14.92 40.64,14.61 37.46,14.61 36.83,15.24 36.83,16.26 C10.1 | C12.1 49.91,16.26 48.26,14.61 44.77,14.61 | 44.77,14.61 41.27,14.61 40.96,14.92 | LED13X3.C 25.4,27.94 21.91,31.43 19.37,31.43 SERIAL.1 | 44.77,14.61 40.64,10.48 RST.1 | v31.75,20.32 LED13X1.C | 27.3,6.98 17.46,16.83 17.46,20 15.24,22.22 13.97,22.22 U$5.GND8 | 32.07,42.55 v32.07,46.99
  Top 0.406: 8.89,40.13 8.89,30.95 | C9.2 11.94,39.5 13.34,38.1 15.88,38.1 | R5.1 72.14,40.03 T1.2 | R9.1 63.88,40.03 T2.2 | R11.1 55.63,40.03 T3.2 | R13.1 47.37,40.03 T4.2 | R17.1 39.12,40.03 T6.2 | R21.1 30.86,40.03 T7.2 | R23.1 22.61,40.03 T8.2 | U$7.10 40.73,29.94 41.27,30.48 47.62,30.48 47.62,29.46 C15.2
  Top 0.61: U$5.GND3 6.56,24.01 U$5.GND7 U$5.GND1 U$5.GND2 U$5.GND8 13.76,24.01 U$5.GND4 | IC2.1 9.12,41.5 8.89,41.28 8.89,40.13 C8.2
  Top 1.016: T8.2 22.35,42.03 | 22.35,42.03 22.86,42.55 30.48,42.55 | 30.48,42.55 32.07,42.55 38.73,42.55 | 38.73,42.55 46.99,42.55 | 46.99,42.55 55.24,42.55 | 55.24,42.55 63.5,42.55 | 63.5,42.55 70.49,42.55 71.75,41.28 71.75,40.41 T1.2 72.23,40.64 74.93,40.64 77.94,43.66 C4.- | T2.2 63.62,42.42 63.5,42.55 | T3.2 55.37,42.42 55.24,42.55 | T4.2 47.11,42.42 46.99,42.55 | T6.2 38.86,42.42 38.73,42.55 | T7.2 30.6,42.42 30.48,42.55 | 22.35,42.03 22.1,42.03 21.59,42.55 15.88,42.55 15.88,38.1 15.88,32.38 | 15.88,32.38 15.24,31.75 12.23,31.75 C2.- 8.89,30.95 5.88,30.95 J1.2 | SERIAL.1 16.51,31.75 15.88,32.38
  Bottom 0.254: TERM1.2 32.07,65.41 29.84,65.41 HOME.1
  Bottom 0.305: v60.32,2.54 SW5.G 60.32,10.79 60.96,10.16 74.29,10.16 | v74.29,2.54 SW3.G 74.29,10.16 | v88.26,2.54 88.26,10.16 | 88.26,10.16 SW2.G 88.26,18.41 88.9,19.05 | 88.9,19.05 88.9,26.67 88.26,27.3 | 88.26,27.3 SW6.G 81.28,27.3 | SW1.G 81.28,27.3 | 74.29,10.16 88.26,10.16 | 88.26,27.3 88.26,35.56 v84.46,39.37 | v81.28,17.78 81.28,27.3 | v92.07,19.05 88.9,19.05 | v31.75,20.32 33.02,20.32 JTAG.1 | v32.07,46.99 32.07,65.41
  Bottom 1.016: U$5.GND7 4.02,31.54 J1.2 10.79,31.75 13.76,28.79 U$5.GND8
N$1
  Top 0.254: R6.2 61.34,19.43 60.32,18.41 SW5.E
N$2
  Top 0.254: R4.2 64.13,30.48 68.58,34.92 80.65,34.92 83.19,32.15 SW6.E
N$3
  Top 0.254: R3.2 65.41,28.57 66.68,27.3 SW1.E
N$5
  Top 0.254: R2.2 62.87,26.67 70.49,19.05 84.46,19.05 85.09,18.41 85.09,16.51 SW2.E
N$6
  Top 0.254: R1.2 62.87,24.76 67.31,20.32 67.31,18.41 69.22,16.51 71.12,15.24 71.12,5.08 SW3.E
N$7
  Top 0.254: LED13X1.A 27.3,20.32 27.3,17.78 R8.2
N$8
  Top 0.406: LED2.C 61.37,37.69 62.87,36.2 63.67,36.2 R9.2
N$10
  Top 0.406: LED6.C 36.58,37.08 37.46,36.2 38.9,36.2 R17.2
N$11
  Top 0.305: U$7.29 39.13,16.53 C10.2
N$12
  Top 0.406: LED3.C 53.09,37.08 53.98,36.2 55.41,36.2 R11.2
N$14
  Top 0.406: LED7.C 28.32,37.08 29.21,36.2 30.65,36.2 R21.2
N$19
  Top 0.406: LED4.C 44.83,37.08 45.72,36.2 47.16,36.2 R13.2
N$21
  Top 0.406: LED8.C 20.07,37.08 20.95,36.2 22.39,36.2 R23.2
N$22
  Top 0.254: R7.2 27.56,24.8 LED13X.A
N$23
  Top 0.406: LED1.C 69.6,37.08 70.49,36.2 71.92,36.2 R5.2
N$25
  Bottom 1.016: 21.34,65.15 15.11,65.15 14.22,66.04 14.22,71.37
N$26
  Top 1.016: 14.22,71.37 14.22,65.15 21.34,65.15
N$27
  Top 0.203: R10.2 LED13X2.A
N$28
  Top 0.203: R14.2 LED13X3.A
N$29  (via drill 4.9)
  other vias: 75.56,58.29
N$30  (via drill 4.9)
  other vias: 51.55,58.29
N$31  (via drill 4.9)
  other vias: 83.56,58.29
N$32  (via drill 4.9)
  other vias: 59.55,58.29
N$33  (via drill 4.9)
  other vias: 67.56,58.29
N$34  (via drill 4.9)
  other vias: 43.55,58.29
N$35  (via drill 4.9)
  other vias: 83.56,146.29
N$36  (via drill 4.9)
  other vias: 91.56,66.29
N$37  (via drill 4.9)
  other vias: 35.55,58.29
N$38  (via drill 4.9)
  other vias: 27.55,58.29
N$39  (via drill 4.9)
  other vias: 19.55,58.29
N$41  (via drill 4.9)
  other vias: 11.55,58.29
N$43  (via drill 4.9)
  other vias: 3.55,58.29
N$44  (via drill 4.9)
  other vias: 3.55,66.29
N$46  (via drill 4.9)
  other vias: 3.55,74.29
N$49  (via drill 4.9)
  other vias: 3.55,82.29
N$50  (via drill 4.9)
  other vias: 3.55,90.29
N$51  (via drill 4.9)
  other vias: 3.55,98.29
N$52  (via drill 4.9)
  other vias: 3.55,106.29
N$53  (via drill 4.9)
  other vias: 3.55,114.29
N$54  (via drill 4.9)
  other vias: 3.55,122.29
N$55  (via drill 4.9)
  other vias: 3.55,130.29
N$56  (via drill 4.9)
  other vias: 3.55,138.29
N$57  (via drill 4.9)
  other vias: 3.55,146.29
N$58  (via drill 4.9)
  other vias: 11.55,146.29
N$59  (via drill 4.9)
  other vias: 19.55,146.29
N$60  (via drill 4.9)
  other vias: 27.55,146.29
N$61  (via drill 4.9)
  other vias: 35.55,146.29
N$62  (via drill 4.9)
  other vias: 43.55,146.29
N$63  (via drill 4.9)
  other vias: 51.55,146.29
N$64  (via drill 4.9)
  other vias: 59.55,146.29
N$65  (via drill 4.9)
  other vias: 67.56,146.29
N$66  (via drill 4.9)
  other vias: 75.56,146.29
N$67  (via drill 4.9)
  other vias: 91.56,146.29
N$68  (via drill 4.9)
  other vias: 91.56,138.29
N$69  (via drill 4.9)
  other vias: 91.56,130.29
N$70  (via drill 4.9)
  other vias: 91.56,122.29
N$71  (via drill 4.9)
  other vias: 91.56,114.29
N$72  (via drill 4.9)
  other vias: 91.56,106.29
N$73  (via drill 4.9)
  other vias: 91.56,98.29
N$74  (via drill 4.9)
  other vias: 91.56,90.29
N$75  (via drill 4.9)
  other vias: 91.56,82.29
N$76  (via drill 4.9)
  other vias: 91.56,74.29
N$77  (via drill 4.9)
  other vias: 91.56,58.29
OUT
  Top 0.254: SP1.+ 34.62,4.12 31.75,6.98 31.75,7.79 Q1.3
RESET  (via drill 0.38)
  Top 0.229: v35.24,13.02 35.56,12.7 37.15,12.7 RST.4 | v36.51,21.91 36.83,21.59 36.83,20.64 U$7.26
  Bottom 0.229: 37.15,21.91 36.83,21.59 36.83,14.61 v35.24,13.02 | JTAG.3 37.15,21.91 | 37.15,21.91 v36.51,21.91
SCL  (via drill 0.38)
  Top 0.229: v32.38,23.49 34.29,23.49 U$7.22
  Bottom 0.229: v32.38,23.49 32.38,22.22 IIC.3
SDA  (via drill 0.38)
  Top 0.229: v30.8,23.18 32.07,24.45 34.29,24.45 U$7.21
  Bottom 0.229: IIC.4 v30.8,23.18
SWC
  Top 0.254: U$7.31 40.73,22.13 JTAG.4
SWD
  Top 0.254: U$7.32 41.53,22.6 JTAG.5
VCC  (via drill 0.5, 0.6)
  Top 0.254: U$7.9 41.53,27.56 JTAG.2 39.94,21.02 U$7.30 | IIC.2 17.78,6.35 17.14,5.71 17.14,2.54 18.41,1.27 39.37,1.27 41.23,3.13 SP1.- 42.55,5.42 42.55,11.43 44.45,13.34 48.26,13.34 54.4,19.47 R12.2 | IC2.4 11.51,48.9 v13.97,48.9
  Top 0.305: v13.97,35.56 12.23,35.56 C2.+ | U$7.30 39.94,19.12 40.64,18.41 42.55,18.41 43.18,17.78 43.18,16.89 C14.1
  Top 0.406: C2.+ 11.43,37.47 10.16,38.73 10.16,39.88 C8.1 | U$7.9 45.19,29.06 C15.1
  Top 0.61: C8.1 11.43,41.15 IC2.2 IC2.4
  Bottom 0.254: v13.97,48.9 15.24,50.16 15.24,60.96 17.14,62.87 22.23,62.87 HOME.3
  Bottom 0.305: JTAG.2 37.46,24.76 25.4,24.76 20.95,29.21 SERIAL.2 17.14,29.21 | 17.14,29.21 16.51,29.21 13.34,32.38 13.34,34.92 v13.97,35.56 | 17.14,29.21 17.14,8.26 IIC.2
VIN
  Top 0.61: JP4.1 JP4.3 JP4.4 | JP4.2 JP4.1 | JP4.1 3.17,34.92 J1.1
VINXY  (via drill 0.6)
  Top 0.305: D8.C v20.32,52.71 | v28.58,52.71 D7.C | v36.83,52.71 D6.C | v45.09,52.71 D4.C | v53.34,52.71 D3.C | D2.C v65.41,52.71
  Top 0.61: JP4.5 JP4.6 | J2.2 75.95,51.05 74.29,52.71 D5.C 82.55,52.71 84.46,50.8 C4.+
  Top 0.813: D1.C 6.35,52.71 5.71,52.07 JP4.6
  Bottom 0.813: JP4.6 6.98,48.9 10.16,45.72 20.32,45.72 | 20.32,45.72 28.58,45.72 | 28.58,45.72 36.83,45.72 | 36.83,45.72 45.09,45.72 | 45.09,45.72 53.34,45.72 | 53.34,45.72 53.98,44.45 65.41,44.45 | 65.41,44.45 73.66,44.45 75.56,46.36 75.56,49.15 J2.2 | v20.32,52.71 20.32,45.72 | v28.58,52.71 28.58,45.72 | v36.83,52.71 36.83,45.72 | v45.09,52.71 45.09,45.72 | v53.34,52.71 53.34,45.72 | v65.41,52.71 65.41,44.45
  Bottom 1.422: J3.1 10.54,65.15 arc90 7.62,62.23 7.62,50.8 arc-90 JP4.6 JP4.5
VUSB
  Top 0.406: IC2.3 13.74,45.49 15.24,46.99 15.24,50.8 13.34,50.8 | U$5.P1 8.86,27.33 8.25,27.94 2.54,27.94 0.63,29.84 0.63,46.36 1.9,47.62 7.62,47.62 8.25,48.26 8.25,49.53 9.53,50.8 13.34,50.8 | D1.A 13.48,50.95 13.34,50.8
  Top 0.61: IC2.3 13.74,40.28 C9.1
X1  (via drill 0.6)
  Top 0.61: X.1 80.01,66.04 85.34,66.04 85.34,139.83 84.46,139.83 84.46,66.93 80.01,66.93 80.01,139.83 79.12,139.83 79.12,66.93 74.68,66.93 74.68,139.83 73.79,139.83 73.79,66.93 69.34,66.93 69.34,139.83 68.45,139.83 68.45,66.93 64.01,66.93 64.01,139.83 63.12,139.83 63.12,66.93 58.67,66.93 58.67,139.83 57.78,139.83 57.78,66.93 53.34,66.93 53.34,139.83 52.45,139.83 52.45,66.93 48.01,66.93 48.01,139.83 47.12,139.83 47.12,66.93 42.67,66.93 42.67,139.83 41.78,139.83 41.78,66.93 37.34,66.93 37.34,139.83 36.45,139.83 36.45,66.93 32,66.93 32,139.83 31.12,139.83 31.12,66.93 26.67,66.93 26.67,139.83 25.78,139.83 25.78,66.93 21.34,66.93 21.34,139.83 20.45,139.83 20.45,66.04 21.21,65.41 X-END.1 | T2.3 61.6,47.84 v61.6,49.53 60.32,50.8 59.29,51.83 D2.A
  Top 1.016: v62.87,49.53 62.87,46.99 | 60.32,50.8 v60.32,49.53 | v61.6,49.53 v61.6,46.36
  Bottom 0.61: X.1 80.01,66.04 87,66.04 87.63,65.41 87.63,55.88 86.36,54.61 64.77,54.61 63.5,53.34 63.5,51.44 62.87,50.8 v61.6,49.53
  Bottom 1.016: 62.87,50.8 v62.87,49.53 | v62.87,49.53 62.87,48.26 60.32,48.26 v60.32,49.53 v61.6,49.53 | v62.87,49.53 v61.6,49.53 | v61.6,46.36 v61.6,49.53
X2  (via drill 0.48)
  Top 0.61: 76.45,63.27 76.45,63.12 87.12,63.12 87.12,141.6 18.67,141.6 18.67,72.26 19.56,72.26 19.56,140.72 24,140.72 24,72.26 24.89,72.26 24.89,140.72 29.34,140.72 29.34,72.26 30.23,72.26 30.23,140.72 34.67,140.72 34.67,72.26 35.56,72.26 35.56,140.72 40.01,140.72 40.01,72.26 40.89,72.26 40.89,140.72 45.34,140.72 45.34,72.26 46.23,72.26 46.23,140.72 50.67,140.72 50.67,72.26 51.56,72.26 51.56,140.72 56.01,140.72 56.01,72.26 56.9,72.26 56.9,140.72 61.34,140.72 61.34,72.26 62.23,72.26 62.23,140.72 66.68,140.72 66.68,72.26 67.56,72.26 67.56,140.72 72.01,140.72 72.01,72.26 72.9,72.26 72.9,140.72 77.34,140.72 77.34,72.26 78.23,72.26 78.23,140.72 82.68,140.72 82.68,72.26 83.57,72.26 83.57,140.72 86.23,140.72 86.23,64.93 v81.15,64.93 v83.82,64.93 v82.93,64.93 v82.04,64.93 | 76.45,63.27 76.45,64.26 X.2 | 76.45,63.27 69.06,63.27 68.2,64.14 49.53,64.14 47.62,62.23 47.62,55.25 50.16,52.71 D3.A 51.04,49.64 T3.3
  Bottom 0.61: X-END.2 19.18,66.04 19.18,66.93 68.45,66.93 68.45,63.12 81.15,63.12 v81.15,64.93 v83.82,64.93 v82.93,64.93 v82.04,64.93
X3  (via drill 0.48)
  Top 0.61: v83.34,68.26 v83.34,69.15 v83.34,70.04 83.34,70.71 81.79,71.37 81.79,139.83 80.9,139.83 80.9,70.48 81.34,70.04 v81.79,70.04 v81.79,69.15 v81.79,68.26 | v78.01,68.26 v78.01,69.15 v78.01,70.04 78.01,70.71 76.45,71.37 76.45,139.83 75.56,139.83 75.56,70.48 76.01,70.04 v76.45,70.04 v76.45,69.15 v76.45,68.26 | v72.68,68.26 v72.68,69.15 v72.68,70.04 72.68,70.71 71.12,71.37 71.12,139.83 70.23,139.83 70.23,70.48 70.68,70.04 v71.12,70.04 v71.12,69.15 v71.12,68.26 | v67.34,68.26 v67.34,69.15 v67.34,70.04 67.34,70.71 65.79,71.37 65.79,139.83 64.9,139.83 64.9,70.48 65.34,70.04 v65.79,70.04 v65.79,69.15 v65.79,68.26 | v62.01,68.26 v62.01,69.15 v62.01,70.04 62.01,70.71 60.45,71.37 60.45,139.83 59.56,139.83 59.56,70.48 60.01,70.04 v60.45,70.04 v60.45,69.15 v60.45,68.26 | v56.67,68.26 v56.67,69.15 v56.67,70.04 56.67,70.71 55.12,71.37 55.12,139.83 54.23,139.83 54.23,70.48 54.67,70.04 v55.12,70.04 v55.12,69.15 v55.12,68.26 | v51.34,68.26 v51.34,69.15 v51.34,70.04 51.34,70.71 49.78,71.37 49.78,139.83 48.9,139.83 48.9,70.48 49.34,70.04 v49.78,70.04 v49.78,69.15 v49.78,68.26 | v46.01,68.26 v46.01,69.15 v46.01,70.04 46.01,70.71 44.45,71.37 44.45,139.83 43.56,139.83 43.56,70.48 44.01,70.04 v44.45,70.04 v44.45,69.15 v44.45,68.26 | v40.67,68.26 v40.67,69.15 v40.67,70.04 40.67,70.71 39.12,71.37 39.12,139.83 38.23,139.83 38.23,70.48 38.67,70.04 v39.12,70.04 v39.12,69.15 v39.12,68.26 | v35.34,68.26 v35.34,69.15 v35.34,70.04 35.34,70.71 33.78,71.37 33.78,139.83 32.89,139.83 32.89,70.48 33.34,70.04 v33.78,70.04 v33.78,69.15 v33.78,68.26
  Top 0.61: v30,68.26 v30,69.15 v30,70.04 30,70.71 28.45,71.37 28.45,139.83 27.56,139.83 27.56,70.48 28,70.04 v28.45,70.04 v28.45,69.15 v28.45,68.26 | v24.67,68.26 v24.67,69.15 v24.67,70.04 24.67,70.71 23.11,71.37 23.11,139.83 22.23,139.83 22.23,70.48 22.67,70.04 v23.11,70.04 v23.11,69.15 v23.11,68.26 | v19.34,68.26 v19.34,69.15 v19.34,70.04 19.34,70.71 17.78,71.37 17.78,141.6 16.89,141.6 16.89,66.17 arc1 X-END.3 | X.3 72.64,65.15 72.39,65.41 42.55,65.41 39.37,62.23 39.37,55.25 41.91,52.71 D4.A 42.78,49.64 T4.3
  Bottom 0.61: X.3 74.68,66.93 82.68,66.93 83.34,67.12 v83.34,68.26 v83.34,69.15 v83.34,70.04 | v81.79,69.15 v81.79,68.26 v78.01,68.26 v78.01,69.15 | v81.79,69.15 v81.79,70.04 v78.01,70.04 v78.01,69.15 | v76.45,70.04 v76.45,69.15 v72.68,69.15 | v76.45,70.04 v76.45,68.26 v72.68,68.26 v72.68,69.15 | v81.79,69.15 v78.01,69.15 | v72.68,69.15 v72.68,70.04 v76.45,70.04 | v71.12,70.04 v71.12,69.15 v67.34,69.15 | v71.12,70.04 v71.12,68.26 v67.34,68.26 v67.34,69.15 | v67.34,69.15 v67.34,70.04 v71.12,70.04 | v65.79,70.04 v65.79,69.15 v62.01,69.15 | v65.79,70.04 v65.79,68.26 v62.01,68.26 v62.01,69.15 | v62.01,69.15 v62.01,70.04 v65.79,70.04 | v60.45,70.04 v60.45,69.15 v56.67,69.15 | v60.45,70.04 v60.45,68.26 v56.67,68.26 v56.67,69.15 | v56.67,69.15 v56.67,70.04 v60.45,70.04 | v55.12,70.04 v55.12,69.15 v51.34,69.15 | v55.12,70.04 v55.12,68.26 v51.34,68.26 v51.34,69.15 | v51.34,69.15 v51.34,70.04 v55.12,70.04 | v49.78,70.04 v49.78,69.15 v46.01,69.15 | v49.78,70.04 v49.78,68.26 v46.01,68.26 v46.01,69.15 | v46.01,69.15 v46.01,70.04 v49.78,70.04 | v44.45,70.04 v44.45,69.15 v40.67,69.15 | v44.45,70.04 v44.45,68.26 v40.67,68.26 v40.67,69.15 | v40.67,69.15 v40.67,70.04 v44.45,70.04 | v39.12,70.04 v39.12,69.15 v35.34,69.15 | v39.12,70.04 v39.12,68.26 v35.34,68.26 v35.34,69.15 | v35.34,69.15 v35.34,70.04 v39.12,70.04 | v33.78,70.04 v33.78,69.15 v30,69.15 | v33.78,70.04 v33.78,68.26 v30,68.26 v30,69.15 | v30,69.15 v30,70.04 v33.78,70.04 | v28.45,70.04 v28.45,69.15 v24.67,69.15 | v28.45,70.04 v28.45,68.26 v24.67,68.26 v24.67,69.15 | v24.67,69.15 v24.67,70.04 v28.45,70.04 | v23.11,70.04 v23.11,69.15 v19.34,69.15 | v23.11,70.04 v23.11,68.26 v19.34,68.26 v19.34,69.15
  Bottom 0.61: v19.34,69.15 v19.34,70.04 v23.11,70.04
XIN32
  Top 0.254: C12.2 46.47,19.95 32,768KHZ.1 45.05,19.95 U$7.1
XOUT32
  Top 0.254: C11.1 46.37,20.85 32,768KHZ.4 43.78,22.76 U$7.2
Y1  (via drill 0.6)
  Top 0.61: T6.3 34.53,49.64 D6.A 31.75,55.48 31.75,60.33 29.84,62.23 15.24,62.23 13.97,63.5 11.43,63.5 10.79,64.14 v10.79,130.17 v10.79,131.44 v10.79,132.72
  Bottom 0.61: Y-END.1 12.45,71.75 12.45,74.93 85.34,74.93 85.34,75.82 12.45,75.82 12.45,80.26 85.34,80.26 85.34,81.15 12.45,81.15 12.45,85.6 85.34,85.6 85.34,86.49 12.45,86.49 12.45,90.93 85.34,90.93 85.34,91.82 12.45,91.82 12.45,96.27 85.34,96.27 85.34,97.16 12.45,97.16 12.45,101.6 85.34,101.6 85.34,102.49 12.45,102.49 12.45,106.93 85.34,106.93 85.34,107.82 12.45,107.82 12.45,112.27 85.34,112.27 85.34,113.16 12.45,113.16 12.45,117.6 85.34,117.6 85.34,118.49 12.45,118.49 12.45,122.94 85.34,122.94 85.34,123.83 12.45,123.83 12.45,128.27 85.34,128.27 85.34,129.16 12.45,129.16 12.45,133.6 85.34,133.6 85.34,134.49 12.45,134.49 12.45,138.94 85.34,138.94 85.34,139.83 11.56,139.83 11.56,134.75 v10.79,133.99 v10.79,132.72 v10.79,131.44 v10.79,130.17
Y2  (via drill 0.48, 0.6)
  Top 0.61: Y-END.2 13.34,69.34 12.45,69.98 12.45,135.64 10.79,136.65 10.79,137.29 v10.45,137.54 v10.45,140.21 v10.45,139.32 v10.45,138.43 | T7.3 26.27,49.64 D7.A 26.27,53.1 24.77,54.61 17.14,54.61 15.24,56.52 15.24,60.33 13.34,62.23 10.16,62.23 8.89,63.5 v8.89,130.17 v8.89,131.44 v8.89,132.72 v8.89,133.99
  Bottom 0.61: v10.45,138.43 v10.45,139.32 v10.45,140.21 v10.45,137.54 10.45,140.72 86.23,140.72 86.23,138.05 17.78,138.05 17.78,137.16 86.23,137.16 86.23,132.72 17.78,132.72 17.78,131.83 86.23,131.83 86.23,127.38 17.78,127.38 17.78,126.49 86.23,126.49 86.23,122.05 17.78,122.05 17.78,121.16 86.23,121.16 86.23,116.71 17.78,116.71 17.78,115.82 86.23,115.82 86.23,111.38 17.78,111.38 17.78,110.49 86.23,110.49 86.23,106.05 17.78,106.05 17.78,105.16 86.23,105.16 86.23,100.71 17.78,100.71 17.78,99.82 86.23,99.82 86.23,95.38 17.78,95.38 17.78,94.49 86.23,94.49 86.23,90.04 17.78,90.04 17.78,89.15 86.23,89.15 86.23,84.71 17.78,84.71 17.78,83.82 86.23,83.82 86.23,79.38 17.78,79.38 17.78,78.49 86.23,78.49 86.23,74.04 17.78,74.04 17.78,73.15 87.12,73.15 87.12,141.6 8.89,141.6 v8.89,133.99 v8.89,132.72 v8.89,131.44 v8.89,130.17
Y3  (via drill 0.48)
  Top 0.229: 12.7,138.11 12.7,137.83
  Top 0.61: 12.64,137.83 12.7,137.83 v13.78,137.83 v14.67,137.83 v15.56,137.83 | v14.67,136.27 v13.78,136.27 v13.78,132.49 v14.67,132.49 | v14.67,136.27 v15.56,136.27 v15.56,132.49 v14.67,132.49 | v15.56,130.94 v14.67,130.94 v14.67,127.16 | v15.56,130.94 v13.78,130.94 v13.78,127.16 v14.67,127.16 | v14.67,136.27 v14.67,132.49 | v14.67,127.16 v15.56,127.16 v15.56,130.94 | v15.56,125.6 v14.67,125.6 v14.67,121.83 | v15.56,125.6 v13.78,125.6 v13.78,121.83 v14.67,121.83 | v14.67,121.83 v15.56,121.83 v15.56,125.6 | v15.56,120.27 v14.67,120.27 v14.67,116.49 | v15.56,120.27 v13.78,120.27 v13.78,116.49 v14.67,116.49 | v14.67,116.49 v15.56,116.49 v15.56,120.27 | v15.56,114.94 v14.67,114.94 v14.67,111.16 | v15.56,114.94 v13.78,114.94 v13.78,111.16 v14.67,111.16 | v14.67,111.16 v15.56,111.16 v15.56,114.94 | v15.56,109.6 v14.67,109.6 v14.67,105.82 | v15.56,109.6 v13.78,109.6 v13.78,105.82 v14.67,105.82 | v14.67,105.82 v15.56,105.82 v15.56,109.6 | v15.56,104.27 v14.67,104.27 v14.67,100.49 | v15.56,104.27 v13.78,104.27 v13.78,100.49 v14.67,100.49 | v14.67,100.49 v15.56,100.49 v15.56,104.27 | v15.56,98.93 v14.67,98.93 v14.67,95.16 | v15.56,98.93 v13.78,98.93 v13.78,95.16 v14.67,95.16 | v14.67,95.16 v15.56,95.16 v15.56,98.93 | v15.56,93.6 v14.67,93.6 v14.67,89.82 | v15.56,93.6 v13.78,93.6 v13.78,89.82 v14.67,89.82 | v14.67,89.82 v15.56,89.82 v15.56,93.6 | v15.56,88.27 v14.67,88.27 v14.67,84.49 | v15.56,88.27 v13.78,88.27 v13.78,84.49 v14.67,84.49 | v14.67,84.49 v15.56,84.49 v15.56,88.27 | v15.56,82.93 v14.67,82.93 v14.67,79.15 | v15.56,82.93 v13.78,82.93 v13.78,79.15 v14.67,79.15 | v14.67,79.15 v15.56,79.15 v15.56,82.93
  Top 0.61: v15.56,77.6 v14.67,77.6 v14.67,73.82 | v15.56,77.6 v13.78,77.6 v13.78,73.82 v14.67,73.82 | v14.67,73.82 v15.56,73.82 v15.56,77.6 | 12.7,137.89 12.7,138.11 12.7,140.97 11.43,142.24 8.89,142.24 7.62,140.97 7.62,56.52 9.53,54.61 14.61,54.61 15.88,52.71 D8.A 18.02,49.64 T8.3
  Bottom 0.61: v13.78,137.83 v14.67,137.83 v15.56,137.83 16.22,137.83 16.89,136.27 85.34,136.27 85.34,135.38 16,135.38 15.56,135.83 v15.56,136.27 v14.67,136.27 v13.78,136.27 | v13.78,132.49 v14.67,132.49 v15.56,132.49 16.22,132.49 16.89,130.94 85.34,130.94 85.34,130.05 16,130.05 15.56,130.49 v15.56,130.94 v14.67,130.94 v13.78,130.94 | v13.78,127.16 v14.67,127.16 v15.56,127.16 16.22,127.16 16.89,125.6 85.34,125.6 85.34,124.71 16,124.71 15.56,125.16 v15.56,125.6 v14.67,125.6 v13.78,125.6 | v13.78,121.83 v14.67,121.83 v15.56,121.83 16.22,121.83 16.89,120.27 85.34,120.27 85.34,119.38 16,119.38 15.56,119.82 v15.56,120.27 v14.67,120.27 v13.78,120.27 | v13.78,116.49 v14.67,116.49 v15.56,116.49 16.22,116.49 16.89,114.94 85.34,114.94 85.34,114.05 16,114.05 15.56,114.49 v15.56,114.94 v14.67,114.94 v13.78,114.94 | v13.78,111.16 v14.67,111.16 v15.56,111.16 16.22,111.16 16.89,109.6 85.34,109.6 85.34,108.71 16,108.71 15.56,109.16 v15.56,109.6 v14.67,109.6 v13.78,109.6 | v13.78,105.82 v14.67,105.82 v15.56,105.82 16.22,105.82 16.89,104.27 85.34,104.27 85.34,103.38 16,103.38 15.56,103.82 v15.56,104.27 v14.67,104.27 v13.78,104.27 | v13.78,100.49 v14.67,100.49 v15.56,100.49 16.22,100.49 16.89,98.93 85.34,98.93 85.34,98.04 16,98.04 15.56,98.49 v15.56,98.93 v14.67,98.93 v13.78,98.93 | v13.78,95.16 v14.67,95.16 v15.56,95.16 16.22,95.16 16.89,93.6 85.34,93.6 85.34,92.71 16,92.71 15.56,93.15 v15.56,93.6 v14.67,93.6 v13.78,93.6 | v13.78,89.82 v14.67,89.82 v15.56,89.82 16.22,89.82 16.89,88.27 85.34,88.27 85.34,87.38 16,87.38 15.56,87.82 v15.56,88.27 v14.67,88.27 v13.78,88.27
  Bottom 0.61: v13.78,84.49 v14.67,84.49 v15.56,84.49 16.22,84.49 16.89,82.93 85.34,82.93 85.34,82.04 16,82.04 15.56,82.49 v15.56,82.93 v14.67,82.93 v13.78,82.93 | v13.78,79.15 v14.67,79.15 v15.56,79.15 16.22,79.15 16.89,77.6 85.34,77.6 85.34,76.71 16,76.71 15.56,77.15 v15.56,77.6 v14.67,77.6 v13.78,77.6 | v13.78,73.82 v14.67,73.82 v15.56,73.82 16.22,73.82 16.89,72.26 87.12,72.26 87.12,71.37 16.89,71.37 16,70.48 16,66.67 Y-END.3
Z1
  Top 0.61: D5.A 67.55,49.64 T1.3 70.83,46.36 77.47,46.36 78.49,47.37 J2.1

### Text on the board
tNames: 11 | 10 | 9 | 8 | 7 | 6 | 5 | 4 | 3 | 2 | 1 | 0 | HOME | A | B | C | D | E | F | G | H | I | J | K | L | VCC-D4-GND / Hall sensor | Temperature / sensor | ON | OFF | +5V | GND | GND | VCC | D1 | Boot | OK | D0 | TX | RESET / (2x BOOT) | SDA | SCL | MBOT | VCC | GND
bNames: (Bobricius) - PeMi Technology / Factory For Materializing Dreams | https://www.youtube.com/bobricius / https://hackaday.io/bobricius / www.tindie.com/stores/bobricius/ / www.tindie.com/stores/kitsforkids/ | www.pemi.technology | HOME / sensor | Temperature / sensor | JTAG | GND | VCC | RST | SWC | SWD
tDocu: 35mil grid 17.5 half